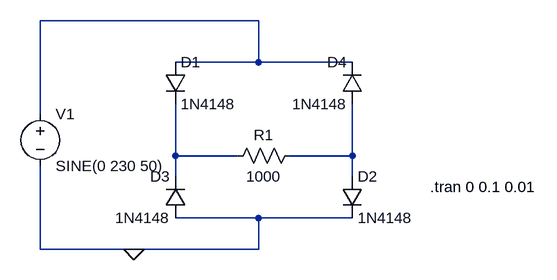
[diagram p0: schematic Full_Wave.asc]
Full_Wave.asc, the LTspice schematic file:
Version 4
SHEET 1 880 680
WIRE 320 128 -16 128
WIRE 320 192 320 128
WIRE 320 192 192 192
WIRE 464 192 320 192
WIRE -16 272 -16 128
WIRE 192 336 192 256
WIRE 288 336 192 336
WIRE 464 336 464 256
WIRE 464 336 368 336
WIRE 192 368 192 336
WIRE 464 368 464 336
WIRE 320 432 192 432
WIRE 464 432 320 432
WIRE -16 480 -16 352
WIRE 128 480 -16 480
WIRE 320 480 320 432
WIRE 320 480 128 480
FLAG 128 480 0
SYMBOL diode 176 192 R0
SYMATTR InstName D1
SYMATTR Value 1N4148
SYMBOL diode 448 368 R0
SYMATTR InstName D2
SYMATTR Value 1N4148
SYMBOL diode 208 432 R180
WINDOW 0 24 64 Left 2
WINDOW 3 24 0 Left 2
SYMATTR InstName D3
SYMATTR Value 1N4148
SYMBOL diode 480 256 R180
WINDOW 0 24 64 Left 2
WINDOW 3 24 0 Left 2
SYMATTR InstName D4
SYMATTR Value 1N4148
SYMBOL res 384 320 R90
WINDOW 0 0 56 VBottom 2
WINDOW 3 32 56 VTop 2
SYMATTR InstName R1
SYMATTR Value 1000
SYMBOL voltage -16 256 R0
WINDOW 123 0 0 Left 0
WINDOW 39 0 0 Left 0
SYMATTR InstName V1
SYMATTR Value SINE(0 230 50)
TEXT 584 384 Left 2 !.tran 0 0.1 0.01

The netlist it stands for:
* Full_Wave.asc
D1 N001 N002 1N4148
D2 N003 0 1N4148
D3 0 N002 1N4148
D4 N003 N001 1N4148
R1 N003 N002 1000
V1 N001 0 SINE(0 230 50)
.model D D
.lib standard.dio
.tran 0 0.1 0.01
.backanno
.end